# EAGLE schematic IRis - Slave Schematic (EAGLE 8.7.0)
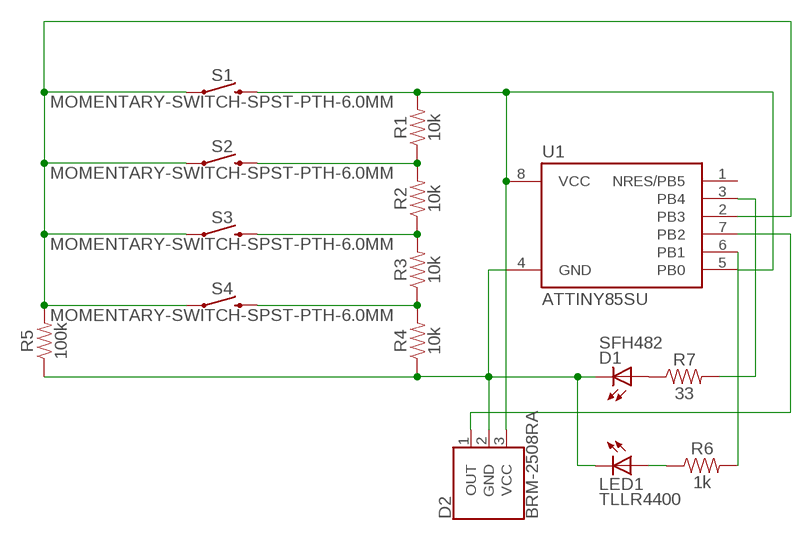
[diagram p0: schematic, sheet 1]

## Parts
D1  SFH482  [SFH482]
D2  BRM-2508RA  [BRM-2508]
LED1  TLLR4400  [LED3MM]
R1  10k  10KOHM-HORIZ-1/4W-5%  [AXIAL-0.3]
R2  10k  10KOHM-HORIZ-1/4W-5%  [AXIAL-0.3]
R3  10k  10KOHM-HORIZ-1/4W-5%  [AXIAL-0.3]
R4  10k  10KOHM-HORIZ-1/4W-5%  [AXIAL-0.3]
R5  100k  100KOHM-HORIZ-1/4W-5%  [AXIAL-0.3]
R6  1k  1KOHM-HORIZ-1/4W-5%  [AXIAL-0.3]
R7  33  33OHM-0603-1/10W-1%  [0603]
S1  MOMENTARY-SWITCH-SPST-PTH-6.0MM  [TACTILE_SWITCH_PTH_6.0MM]
S2  MOMENTARY-SWITCH-SPST-PTH-6.0MM  [TACTILE_SWITCH_PTH_6.0MM]
S3  MOMENTARY-SWITCH-SPST-PTH-6.0MM  [TACTILE_SWITCH_PTH_6.0MM]
S4  MOMENTARY-SWITCH-SPST-PTH-6.0MM  [TACTILE_SWITCH_PTH_6.0MM]
U1  ATTINY85SU  [ATTINY85]

## Nets
N$1: R1.P$1 R2.P$2 S2.3
N$2: R2.P$1 R3.P$2 S3.3
N$3: R3.P$1 R4.P$2 S4.3
N$4: D2.3(VCC) R1.P$2 S1.3 U1.5(PB0) U1.8(VCC)
N$5: R5.P$2 S1.1 S2.1 S3.1 S4.1 U1.2(PB3)
N$6: D1.K(C) D2.2(GND) LED1.K(C) R4.P$1 R5.P$1 U1.4(GND)
N$7: R7.2 U1.3(PB4)
N$8: D2.1(OUT) U1.7(PB2)
N$9: D1.A R7.1
N$10: R6.P$2 U1.6(PB1)
N$11: LED1.A R6.P$1
Unconnected: U1.1(NRES/PB5)

## Library data of the parts
D1 = led:SFH482: IR LED infrared emitting diode, Infineon
D2 = SparkFun-Sensors:BRM-2508: BRM-2508 IR Receiver Module 2.7V/5.5V IR Receiver with Low Power Consumption, High-immunity Against Ambient Light. Example Datasheet <http://www.sinoskysun.com/upload/20110512/201105120447164615.PDF>; PROD_ID: COMP-12059
LED1 = led:TLLR4400: Low Current (2mA) LED 3 mm Tinted Diffused Package color RED Source: Data sheet <http://www.farnell.com/datasheets/391100.pdf>; MF: VISHAY SEMICONDUCTOR; OC_FARNELL: 1612437
R1-R4 = SparkFun-Resistors:10KOHM: 10kΩ resistor A resistor is a passive two-terminal electrical component that implements electrical resistance as a circuit element. Resistors act to reduce current flow, and, at the same time, act to lower voltage levels within circuits. - Wikipedia; PROD_ID: RES-09435
R5 = SparkFun-Resistors:100KOHM: 100kΩ resistor A resistor is a passive two-terminal electrical component that implements electrical resistance as a circuit element. Resistors act to reduce current flow, and, at the same time, act to lower voltage levels within circuits. - Wikipedia; PROD_ID: RES-10686
R6 = SparkFun-Resistors:1KOHM: 1kΩ resistor A resistor is a passive two-terminal electrical component that implements electrical resistance as a circuit element. Resistors act to reduce current flow, and, at the same time, act to lower voltage levels within circuits. - Wikipedia; PROD_ID: RES-08380
R7 = SparkFun-Resistors:33OHM: 33Ω resistor A resistor is a passive two-terminal electrical component that implements electrical resistance as a circuit element. Resistors act to reduce current flow, and, at the same time, act to lower voltage levels within circuits. - Wikipedia; PROD_ID: RES-08270
S1-S4 = SparkFun-Switches:MOMENTARY-SWITCH-SPST: Momentary Switch (Pushbutton) - SPST Normally-open (NO) SPST momentary switches (buttons, pushbuttons). Variants PTH-12MM - 12mm square, through-hole Momentary Pushbutton Switch - 12mm Square <https://www.sparkfun.com/products/9190> (COM-09190) PTH-6.0MM, PTH-6.0MM-KIT - 6.0mm square, through-hole Mini Pushbutton Switch <https://www.sparkfun.com/products/97> (COM-00097) KIT package intended for soldering kit's - only one side of pads' copper is exposed. PTH-RIGHT-ANGLE-KIT - Right-angle, through-hole Right Angle Tactile Button <https://www.sparkfun.com/products/10791> - Used on SparkFun BigTime Watch Kit <https://www.sparkfun.com/products/11734> SMD-12MM - 12mm square, surface-mount Tactile Button - SMD (12mm) <https://www.sparkfun.com/products/12993> (COM-12993) Used on SparkFun PicoBoard <https://www.sparkfun.com/products/11888> SMD-4.5MM - 4.5mm Square Trackball Switch Used on SparkFun Blackberry Trackballer Breakout <https://www.sparkfun.com/products/13169> SMD-4.6MMX2.8MM - 4.60mm x 2.80mm, surface mount Used on SparkFun SAMD21 Mini Breakout <https://www.sparkfun.com/products/13664> SMD-5.2MM, SMD-5.2-REDUNDANT - 5.2mm square, surface-mount Mini Pushbutton Switch - SMD <https://www.sparkfun.com/products/8720> (COM-08720) Used on Arduino Pro Mini <https://www.sparkfun.com/products/11114> REDUNDANT package connects both switch circuits together SMD-6.0X3.5MM - 6.0 x 3.5mm, surface mount Momentary Reset Switch SMD <https://www.sparkfun.com/products/8229> (COM-08229) SMD-6.2MM-TALL - 6.2mm square, surface mount Tactile Button - SMD (6mm) <https://www.sparkfun.com/products/12992> Used on SparkFun Digital Sandbox <https://www.sparkfun.com/products/12651> SMD-RIGHT-ANGLE - Right-angle, surface mount Used on SparkFun Block for Intel® Edison - Arduino <https://www.sparkfun.com/products/13036>; PROD_ID: SWCH-08441; SF_SKU: COM-00097
U1 = ATtiny85:ATTINY85: ATMEL ATtiny 85